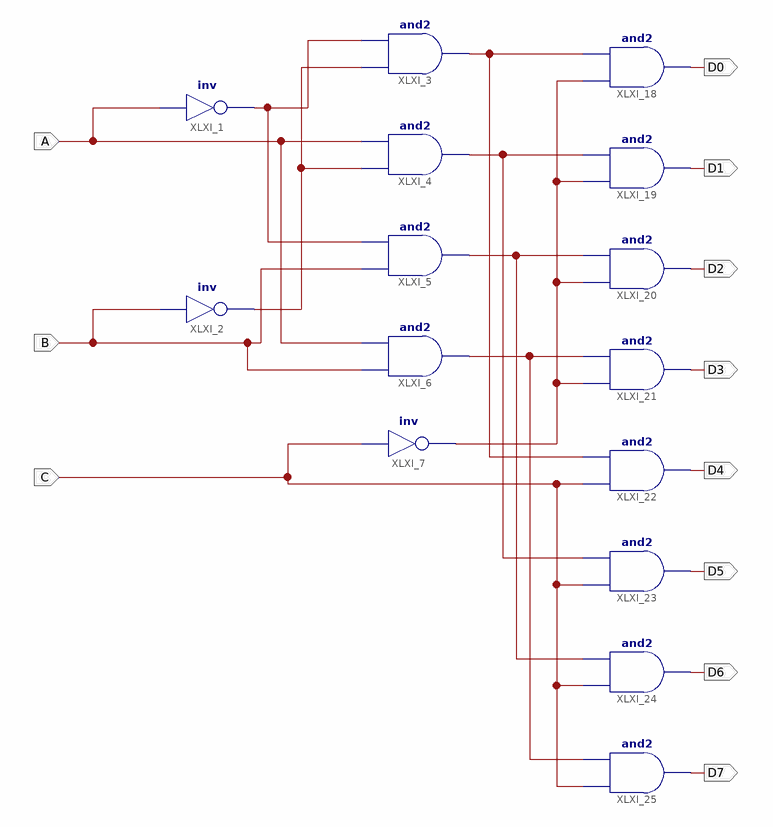
[diagram p0: schematic sheet 1]
// Xilinx ISE schematic Decoder_38_sch.sch (kintex7) as structural Verilog: 15 symbols, 11 ports
module Decoder_38_sch (
  input  A,
  input  B,
  input  C,
  output D2,
  output D3,
  output D4,
  output D5,
  output D6,
  output D7,
  output D0,
  output D1
);

  wire XLXN_2, XLXN_6, XLXN_33, XLXN_35, XLXN_37, XLXN_39, XLXN_43;

  not XLXI_1 (XLXN_2, A);
  not XLXI_2 (XLXN_6, B);
  and XLXI_3 (XLXN_33, XLXN_6, XLXN_2);
  and XLXI_4 (XLXN_35, XLXN_6, A);
  and XLXI_5 (XLXN_37, B, XLXN_2);
  and XLXI_6 (XLXN_39, B, A);
  not XLXI_7 (XLXN_43, C);
  and XLXI_18 (D0, XLXN_43, XLXN_33);
  and XLXI_19 (D1, XLXN_43, XLXN_35);
  and XLXI_20 (D2, XLXN_43, XLXN_37);
  and XLXI_21 (D3, XLXN_43, XLXN_39);
  and XLXI_22 (D4, C, XLXN_33);
  and XLXI_23 (D5, C, XLXN_35);
  and XLXI_24 (D6, C, XLXN_37);
  and XLXI_25 (D7, C, XLXN_39);
endmodule
